# EAGLE schematic v1.2 (EAGLE 6.0)
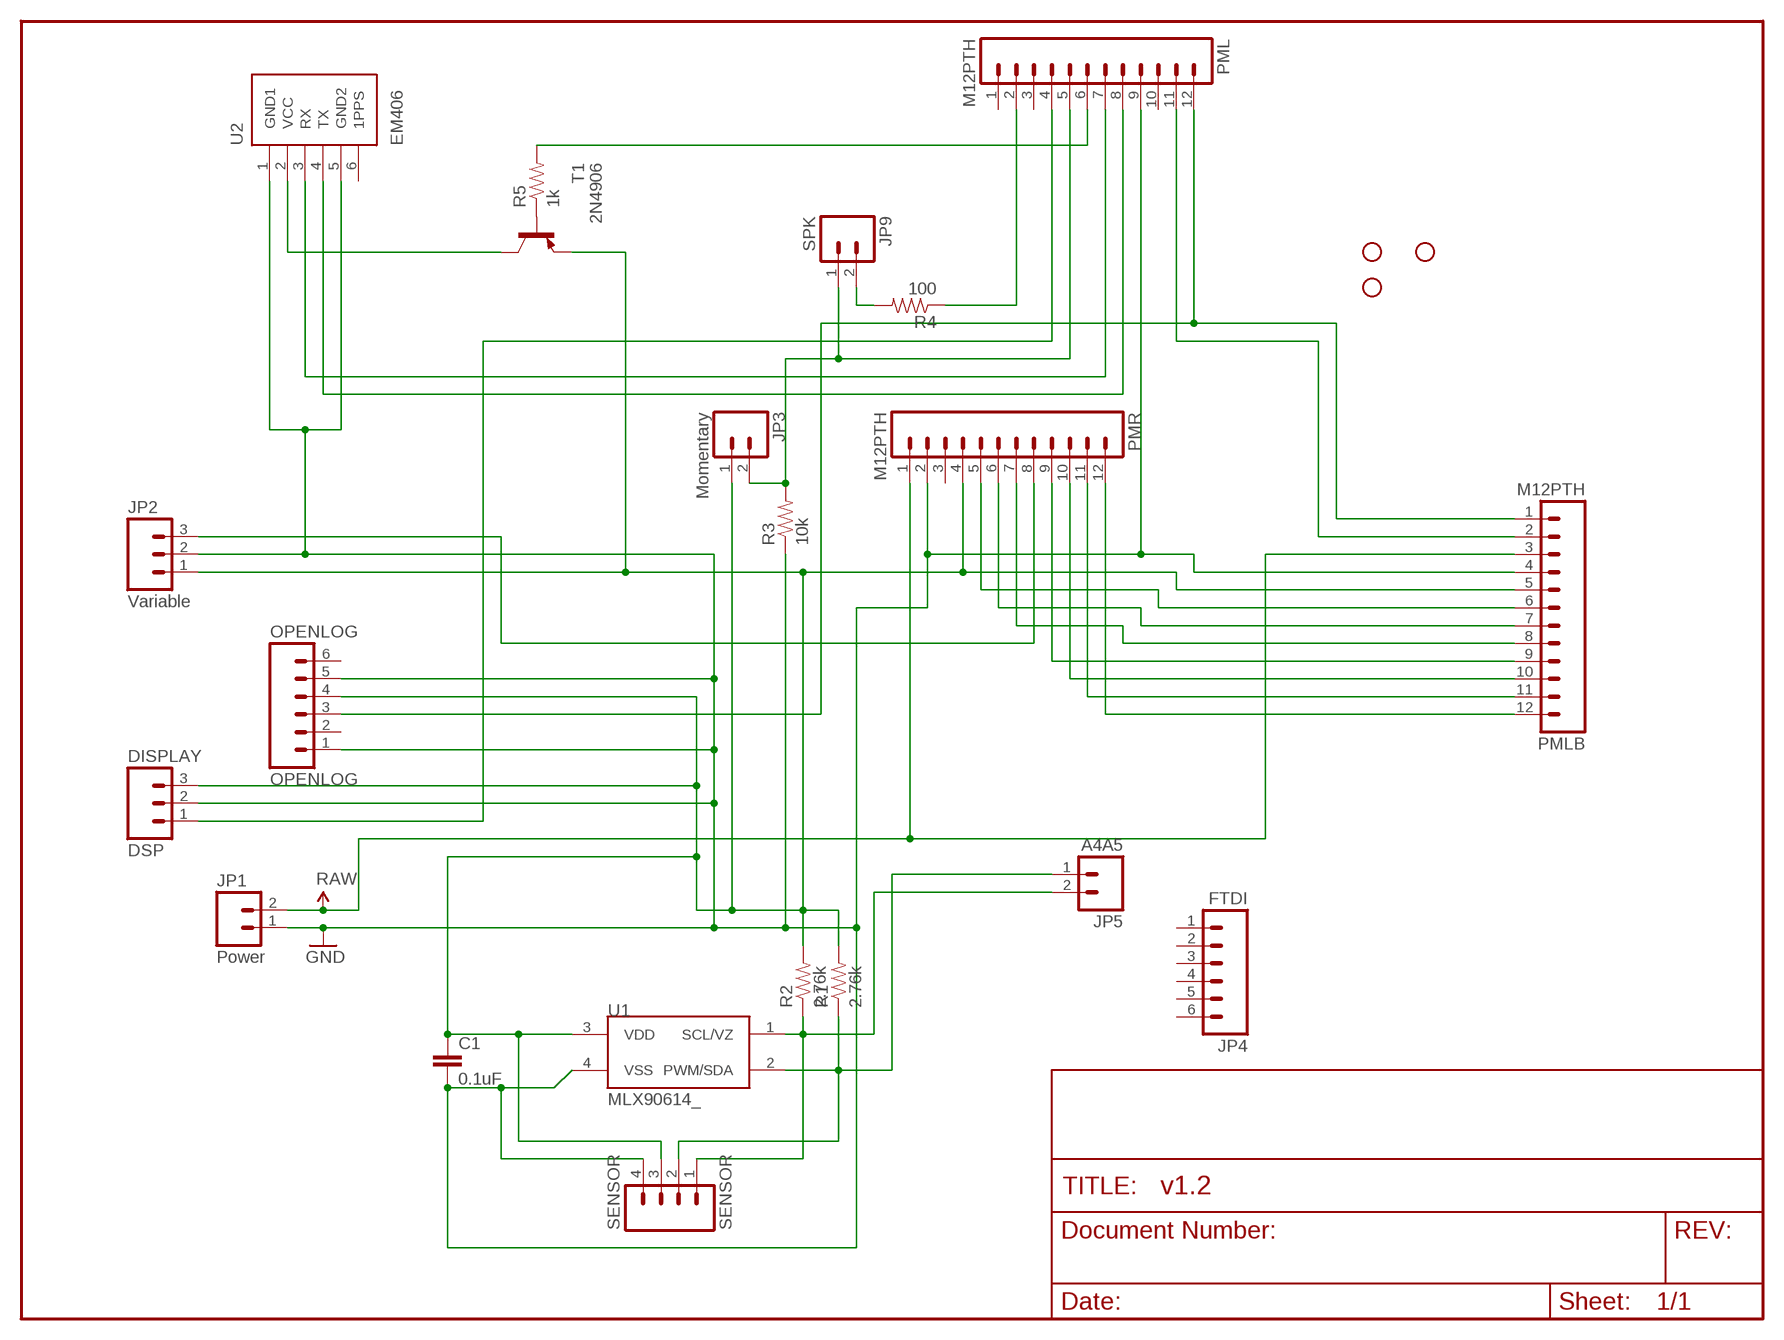
[diagram p0: schematic, sheet 1]

## Parts
2N4906  T1  2N3906-PNP-TO92-EBC  [TO92-EBC]
C1  0.1uF  CAPPTH3  [CAP-PTH-LARGE]
DISPLAY  DSP  M03SCREW_LOCK  [SCREWTERMINAL-3.5MM-3_LOCK.007S]
JP1  Power  M02JST-PTH-2  [JST-2-PTH]
JP2  Variable  M03SCREW_LOCK  [SCREWTERMINAL-3.5MM-3_LOCK.007S]
JP3  Momentary  M02JST-PTH-2  [JST-2-PTH]
JP4  FTDI  M06SIP  [1X06]
JP5  A4A5  M02PTH  [1X02]
JP6  STAND-OFFTIGHT  [STAND-OFF-TIGHT]
JP7  STAND-OFFTIGHT  [STAND-OFF-TIGHT]
JP8  STAND-OFFTIGHT  [STAND-OFF-TIGHT]
JP9  SPK  M023.5MM  [SCREWTERMINAL-3.5MM-2]
OPENLOG  OPENLOG  M06LOCK  [1X06_LOCK]
PML  M12PTH  [1X12]
PMLB  M12PTH  [1X12]
PMR  M12PTH  [1X12]
R1  2.76k  RESISTORPTH-1/4W  [AXIAL-0.4]
R2  2.76k  RESISTORPTH-1/4W  [AXIAL-0.4]
R3  10k  RESISTORPTH-1/4W  [AXIAL-0.4]
R4  100  RESISTORPTH-1/4W  [AXIAL-0.4]
R5  1k  RESISTORPTH-1/4W  [AXIAL-0.4]
SENSOR  SENSOR  M04SCREW_LOCK  [SCREWTERMINAL-3.5MM-4_LOCK]
U1  MLX90614_  [TO-39]
U2  EM406  [EM406]

## Nets
GND: C1.2 DISPLAY.2 JP1.1 JP2.2 OPENLOG.1 OPENLOG.5 PML.9 PMLB.4 PMR.2 R3.P$1 SENSOR.4 U1.4(VSS) U2.1(GND1) U2.5(GND2)
N$2: JP5.1 R1.P$1 SENSOR.2 U1.2(PWM/SDA)
N$3: JP3.2 JP9.1 PML.5 R3.P$2
N$4: DISPLAY.1 PML.4
N$5: JP2.3 PMR.8
N$6: OPENLOG.3 PML.12 PMLB.1
N$7: 2N4906.E C1.1 DISPLAY.3 JP2.1 JP3.1 OPENLOG.4 PMLB.5 PMR.4 R1.P$2 R2.P$2 SENSOR.3 U1.3(VDD)
N$8: PML.11 PMLB.2
N$9: PMLB.12 PMR.12
N$10: PMLB.11 PMR.11
N$11: PMLB.10 PMR.10
N$12: PMLB.9 PMR.9
N$13: PMLB.8 PMR.7
N$14: PMLB.7 PMR.6
N$15: PMLB.6 PMR.5
N$16: JP9.2 R4.P$2
N$17: PML.2 R4.P$1
N$18: 2N4906.B R5.P$1
N$19: 2N4906.C U2.2(VCC)
N$20: PML.8 U2.4(TX)
N$21: PML.7 U2.3(RX)
N$22: PML.6 R5.P$2
SENSOR: JP5.2 R2.P$1 SENSOR.1 U1.1(SCL/VZ)
VCC: JP1.2 PMLB.3 PMR.1 ; supply symbol labelled RAW
Unconnected: JP4.1 JP4.2 JP4.3 JP4.4 JP4.5 JP4.6 OPENLOG.2 OPENLOG.6 PML.1 PML.3 PML.10 PMR.3 U2.6(1PPS)

## Library data of the parts
2N4906 = transistor-neu-to92:*-PNP-: PNP Transistror
C1 = SparkFun:CAP: Capacitor Standard 0603 ceramic capacitor, and 0.1" leaded capacitor.
DISPLAY JP2 = SparkFun:M03: Header 3 Standard 3-pin 0.1" header. Use with straight break away headers (SKU : PRT-00116), right angle break away headers (PRT-00553), swiss pins (PRT-00743), machine pins (PRT-00117), and female headers (PRT-00115). Molex polarized connector foot print use with SKU : PRT-08232 with associated crimp pins and housings.
JP1 JP3 JP5 JP9 = SparkFun:M02: Header 2 Standard 2-pin 0.1" header. Use with straight break away headers (SKU : PRT-00116), right angle break away headers (PRT-00553), swiss pins (PRT-00743), machine pins (PRT-00117), and female headers (PRT-00115). Molex polarized connector foot print use with SKU : PRT-08233 with associated crimp pins and housings.
JP4 OPENLOG = SparkFun:M06: Header 6 Standard 6-pin 0.1" header. Use with straight break away headers (SKU : PRT-00116), right angle break away headers (PRT-00553), swiss pins (PRT-00743), machine pins (PRT-00117), and female headers (PRT-00115). Molex polarized connector foot print use with SKU : PRT-08094 with associated crimp pins and housings. NOTES ON THE VARIANTS LOCK and LOCK_LONGPADS... This footprint was designed to help hold the alignment of a through-hole component (i.e. 6-pin header) while soldering it into place. You may notice that each hole has been shifted either up or down by 0.005 of an inch from it's more standard position (which is a perfectly straight line). This slight alteration caused the pins (the squares in the middle) to touch the edges of the holes. Because they are alternating, it causes a "brace" to hold the component in place. 0.005 has proven to be the perfect amount of "off-center" position when using our standard breakaway headers. Although looks a little odd when you look at the bare footprint, once you have a header in there, the alteration is very hard to notice. Also, if you push a header all the way into place, it is covered up entirely on the bottom side. This idea of altering the position of holes to aid alignment will be further integrated into the Sparkfun Library for other footprints. It can help hold any component with 3 or more connection pins.
JP6-JP8 = SparkFun:STAND-OFF: Stand Off This is the mechanical footprint for a #4 phillips button head screw. Use the keepout ring to avoid running the screw head into surrounding components. SKU : PRT-00447
PML PMLB PMR = SparkFun:M12: Header 12 Standard 12-pin 0.1" header. Use with straight break away headers (SKU : PRT-00116), right angle break away headers (PRT-00553), swiss pins (PRT-00743), machine pins (PRT-00117), and female headers (PRT-00115).
R1-R5 = SparkFun:RESISTOR: Resistor Basic schematic elements and footprints for 0603, 1206, and PTH resistors.
SENSOR = SparkFun:M04: Header 4 Standard 4-pin 0.1" header. Use with straight break away headers (SKU : PRT-00116), right angle break away headers (PRT-00553), swiss pins (PRT-00743), machine pins (PRT-00117), and female headers (PRT-00115). Molex polarized connector foot print use with SKU : PRT-08231 with associated crimp pins and housings. 1MM SMD Version SKU: PRT-10208
U1 = SparkFun:MLX90614: Melexis IR Thermometer
U2 = SparkFun:EM406: EM406 Connector Proven layout and schematic for EM406 connector. Spark Fun Electronics SKU : GPS-00579